# Altium project reciever.PrjPcb
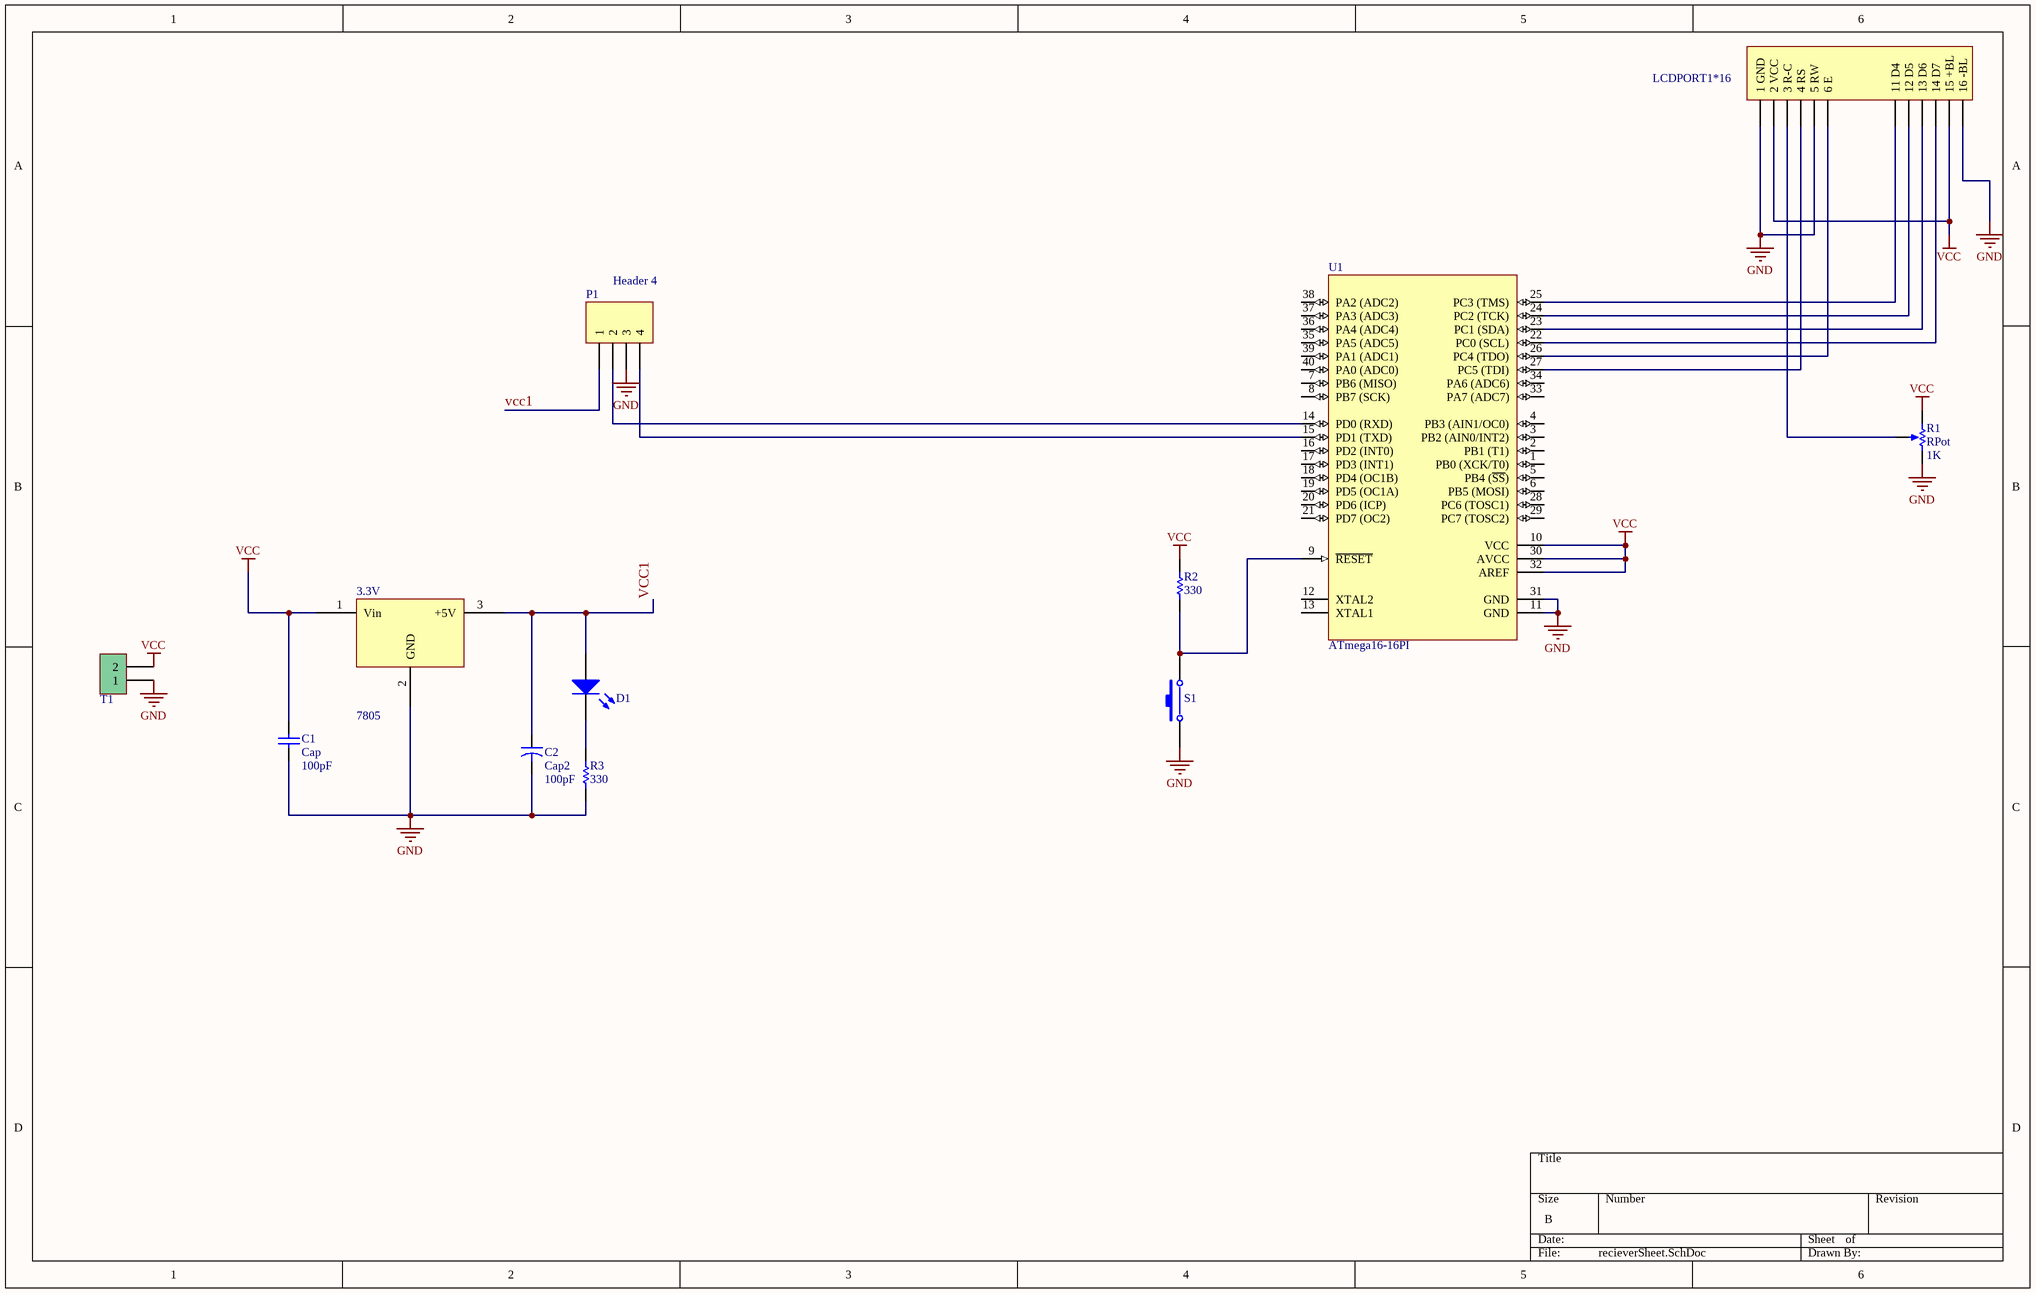
[diagram p0: recieverSheet.SchDoc]
1 sheet, 12 parts. Net scope: global (net labels, ports and power ports of the same name join across sheets).
Board file: PCB2.PcbDoc

## Sheet recieverSheet.SchDoc
size B

### Parts
3.3V  7805  [My_TO-220]
C1  Cap  value 100pF  [RAD-0.1]
C2  Cap2  value 100pF  [CAPR5-4X5]
D1  LED 3mm  [LED-3mm]  (value not drawn)
LCDPORT1*16  LCDPORT1*16  [HDR1X16]  (value not drawn)
P1  Header 4  [HDR1X4]
R1  RPot  value 1K  [VR5]
R2  value 330  [Res50]  (hidden comment: Resistor vertical)
R3  value 330  [Res50]  (hidden comment: Resistor vertical)
S1  PB-2pin  [PB-2pin]  (value not drawn)
T1  Phoenix terminal  [phoenix terminal 2]  (value not drawn)
U1  ATmega16-16PI  [My_40P6]

### Nets
GND: 3.3V.2(GND) C1.1 C2.2 LCDPORT1*16.1(1_GND) LCDPORT1*16.5(5_RW) LCDPORT1*16.16(16_-BL) P1.3 R1.2(BOT) R3.1 S1.1 T1.1 U1.11(GND) U1.31(GND)
VCC: 3.3V.1(Vin) C1.2 LCDPORT1*16.2(2_VCC) LCDPORT1*16.15(15_+BL) R1.1(TOP) R2.2 T1.2 U1.10(VCC) U1.30(AVCC) U1.32(AREF)
VCC1: 3.3V.3(+5V) C2.1 D1.1(A) P1.1
NetD1_2: D1.2(K) R3.2
NetLCDPORT1*16_3: LCDPORT1*16.3(3_R-C) R1.3(TAP)
NetLCDPORT1*16_4: LCDPORT1*16.4(4_RS) U1.27(PC5_(TDI))
NetLCDPORT1*16_6: LCDPORT1*16.6(6_E) U1.26(PC4_(TDO))
NetLCDPORT1*16_11: LCDPORT1*16.11(11_D4) U1.25(PC3_(TMS))
NetLCDPORT1*16_12: LCDPORT1*16.12(12_D5) U1.24(PC2_(TCK))
NetLCDPORT1*16_13: LCDPORT1*16.13(13_D6) U1.23(PC1_(SDA))
NetLCDPORT1*16_14: LCDPORT1*16.14(14_D7) U1.22(PC0_(SCL))
NetP1_2: P1.2 U1.14(PD0_(RXD))
NetP1_4: P1.4 U1.15(PD1_(TXD))
NetR2_1: R2.1 S1.2 U1.9(~{RESET})

Not connected (* = marked no-connect by the designer): U1 1(PB0_(XCK/T0)) 2(PB1_(T1)) 3(PB2_(AIN0/INT2)) 4(PB3_(AIN1/OC0)) 5(PB4_(~{SS})) 6(PB5_(MOSI)) 7(PB6_(MISO)) 8(PB7_(SCK)) 12(XTAL2) 13(XTAL1) 16(PD2_(INT0)) 17(PD3_(INT1)) 18(PD4_(OC1B)) 19(PD5_(OC1A)) 20(PD6_(ICP)) 21(PD7_(OC2)) 28(PC6_(TOSC1)) 29(PC7_(TOSC2)) 33(PA7_(ADC7)) 34(PA6_(ADC6)) 35(PA5_(ADC5)) 36(PA4_(ADC4)) 37(PA3_(ADC3)) 38(PA2_(ADC2)) 39(PA1_(ADC1)) 40(PA0_(ADC0))

### Library data of the parts
3.3V = 7805: Regulator
C1 = Cap: Capacitor; Published: 8-Jun-2000; LatestRevisionDate: 17-Jul-2002; LatestRevisionNote: Re-released for DXP Platform.; PackageReference: RAD-0.3; Publisher: Altium Limited; PackageDescription: Radial Cap, Thru-Hole; 2 Leads; 0.3 in Pin Spacing
C2 = Cap2: Capacitor; Published: 23-Sep-2002; PackageReference: CAPR5-4X5; Publisher: Altium Limited; PackageDescription: Capacitor; 2 Leads
D1 = LED 3mm: Typical LED; Designer: Seyed Mohsen Ghasemian; Published: 02/04/2012; PackageReference: LED; Publisher: www.picpars.com; PackageDescription: LED; 2 Leads
LCDPORT1*16 = LCDPORT 1*16: LCDPORT 1*16; 80mm*36mm; Designer: Seyed Mohsen Ghasemain; ComponentLinkURL: www.picpars.com
P1 = Header 4: Header, 4-Pin; LatestRevisionDate: 17-Jul-2002; LatestRevisionNote: Re-released for DXP Platform.; Publisher: Altium Limited
R1 = RPot: Potentiometer; Sim Note: Enter the Resistance value and the set point into parameter fields.; Set Position: 0.5; Published: 8-Jun-2000; LatestRevisionDate: 17-Jul-2002; LatestRevisionNote: Re-released for DXP Platform.; PackageReference: VR5; Publisher: Altium Limited; PackageDescription: Variable Resistor, Thru-Hole; 3 Leads
R2 R3 = Resistor vertical: Resistor 0.5; Publisher: Seyed mohsen ghasemian; WEB: www.picpars.com
S1 = PB-2pin: Switch; E-mail: picpars@gmail.com; Designer: Seyed Mohsen Ghasemian; Publisher: www.picpars.com; WEB: www.picpars.com
T1 = Phoenix terminal 2: Terminal 2 Pin; Designer: Seyed Mohsen Ghasemain; E-mail: picpars@gmail.com; ComponentLinkURL: www.picpars.com
U1 = ATmega16-16PI: AVR 16K Bytes of In-System Programmable Flash Memory; Published: 17-Sep-2003; LatestRevisionDate: 04-Mar-2005; LatestRevisionNote: Stylized 3D Model Added.; DatasheetVersion: 2466E-AVR-10/02; PackageVersion: Dec-1999; PackageReference: 40P6; Publisher: Altium Limited; PackageDescription: DIP; 40 Leads; Row Spacing 15.24 mm; Pitch 2.54 mm; ComponentLink1Description: Manufacturer Link; ComponentLink1URL: http://www.atmel.com; ComponentLink2Description: Datasheet; ComponentLink2URL: http://www.atmel.com/dyn/resources/prod_documents/doc2466.pdf